# Altium schematic sheet FM33LE025_NB_4 V0.10.SchDoc: WX0.006.694DL
size A2; CompanyName: 浙江威星智能仪表股份有限公司; DocumentNumber: NB阀控水表; Revision: 1A; SheetNumber: 1; SheetTotal: 2; PageSetup: Record=PageOptions|CenterHorizontal=True|CenterVertical=True|PrintScale=1.04|XCorrection=1.00|YCorrection=1.00|PrintKind=0|BorderSize=5000000|LeftOffset=0|BottomOffset=0|Orientation=2|PaperLength=1000|PaperWidth=1000|Scale=100|PaperSource=7|PrintQuality=-3|MediaType=1|DitherType=10|PrintScaleMode=1|PaperKind=A3|PaperIndex=8
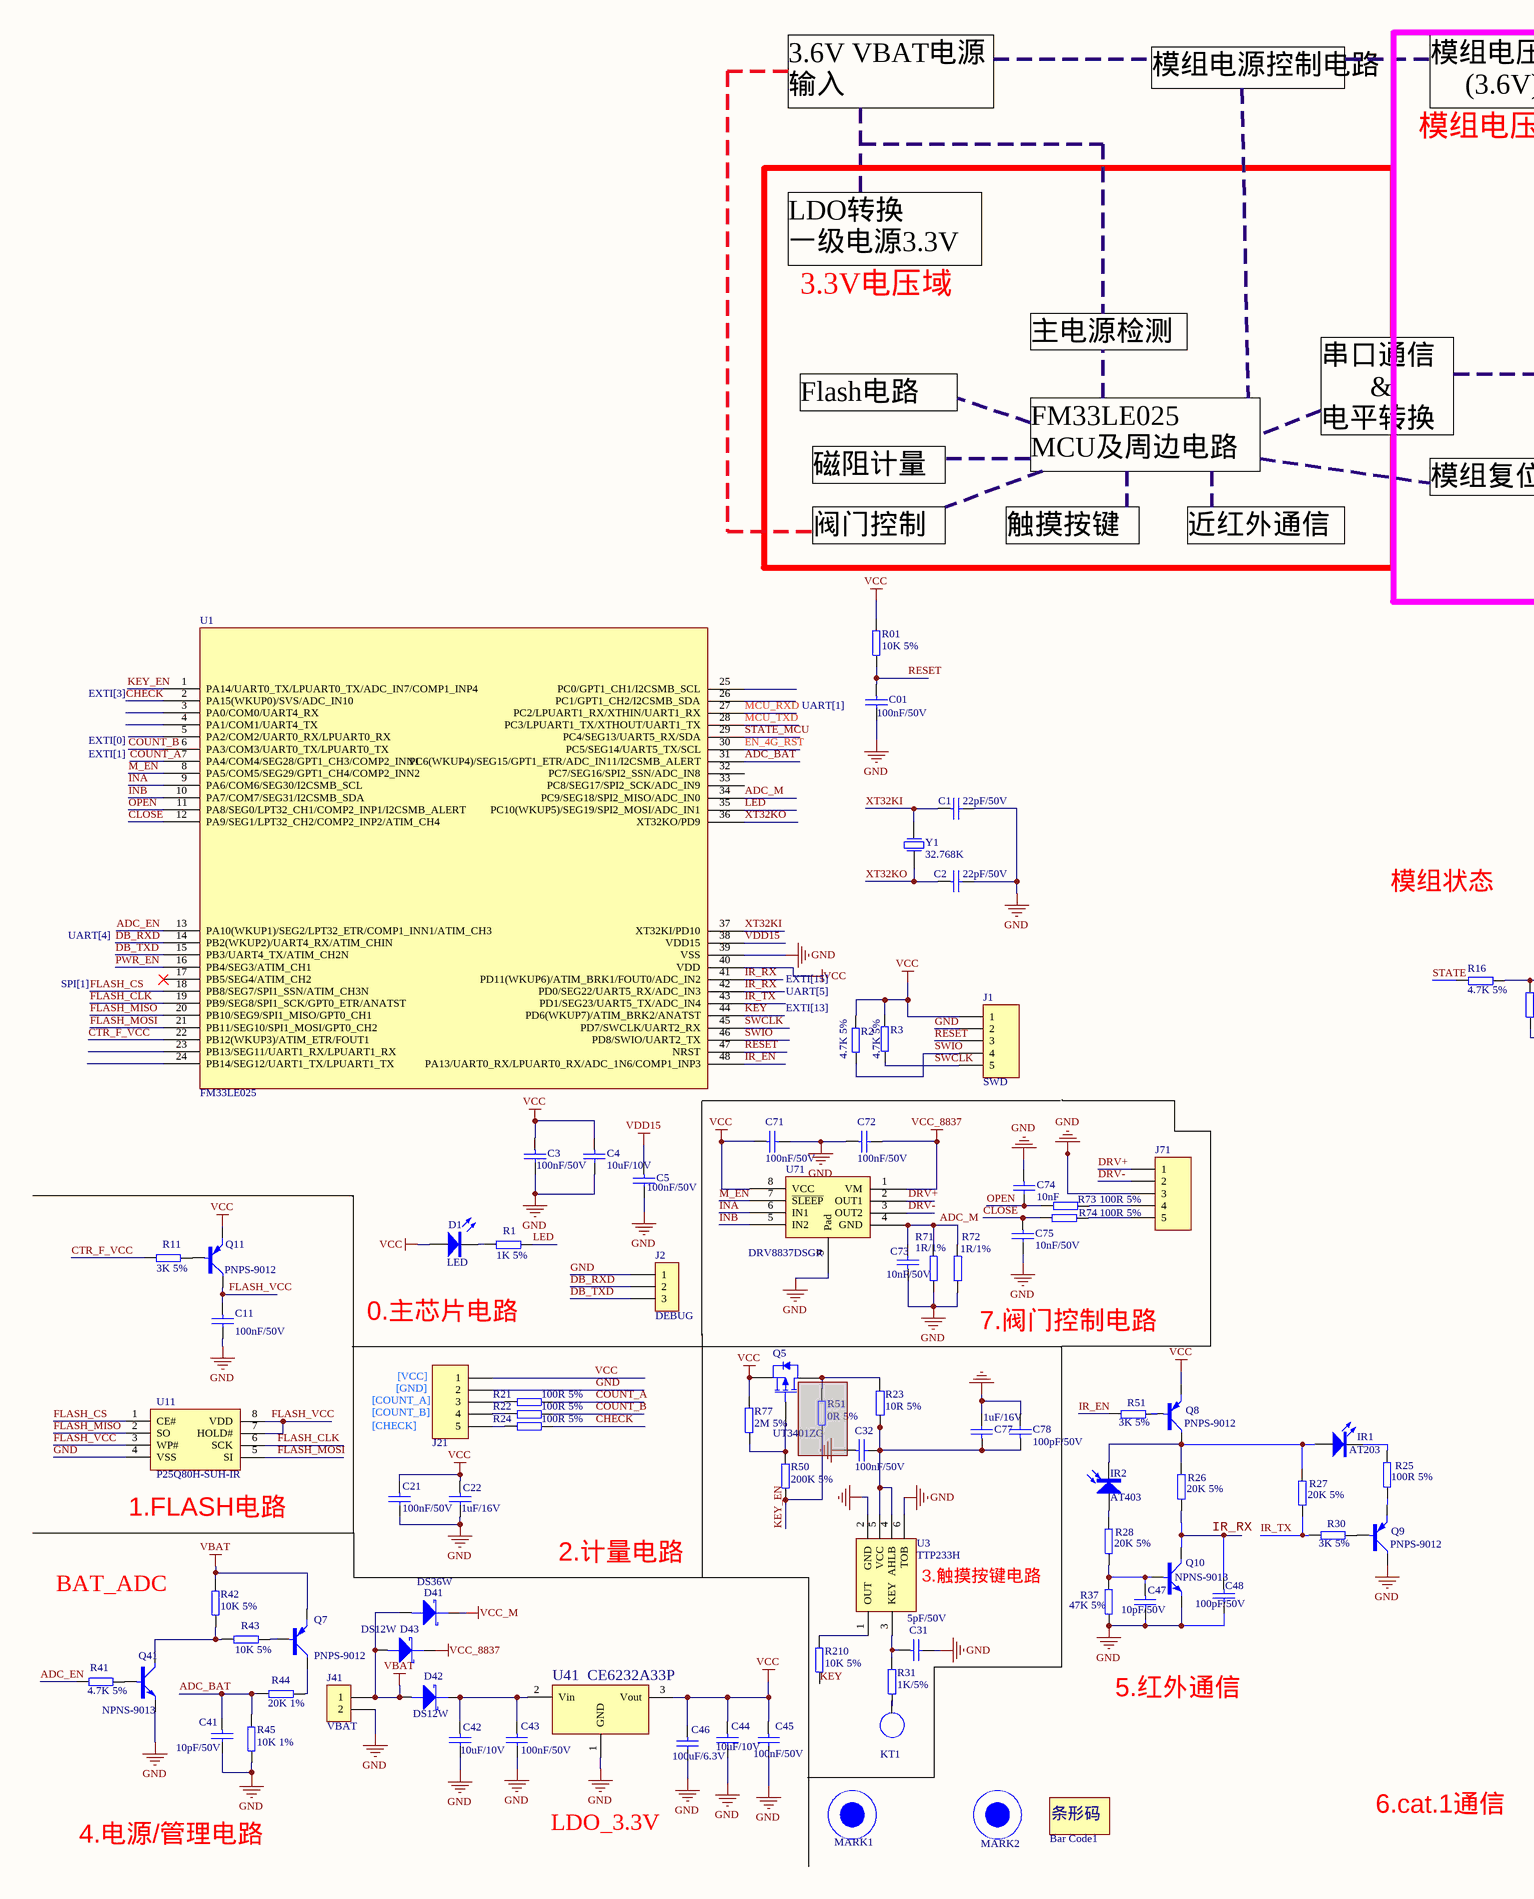
[diagram p0: FM33LE025_NB_4 V0.10.SchDoc, left]
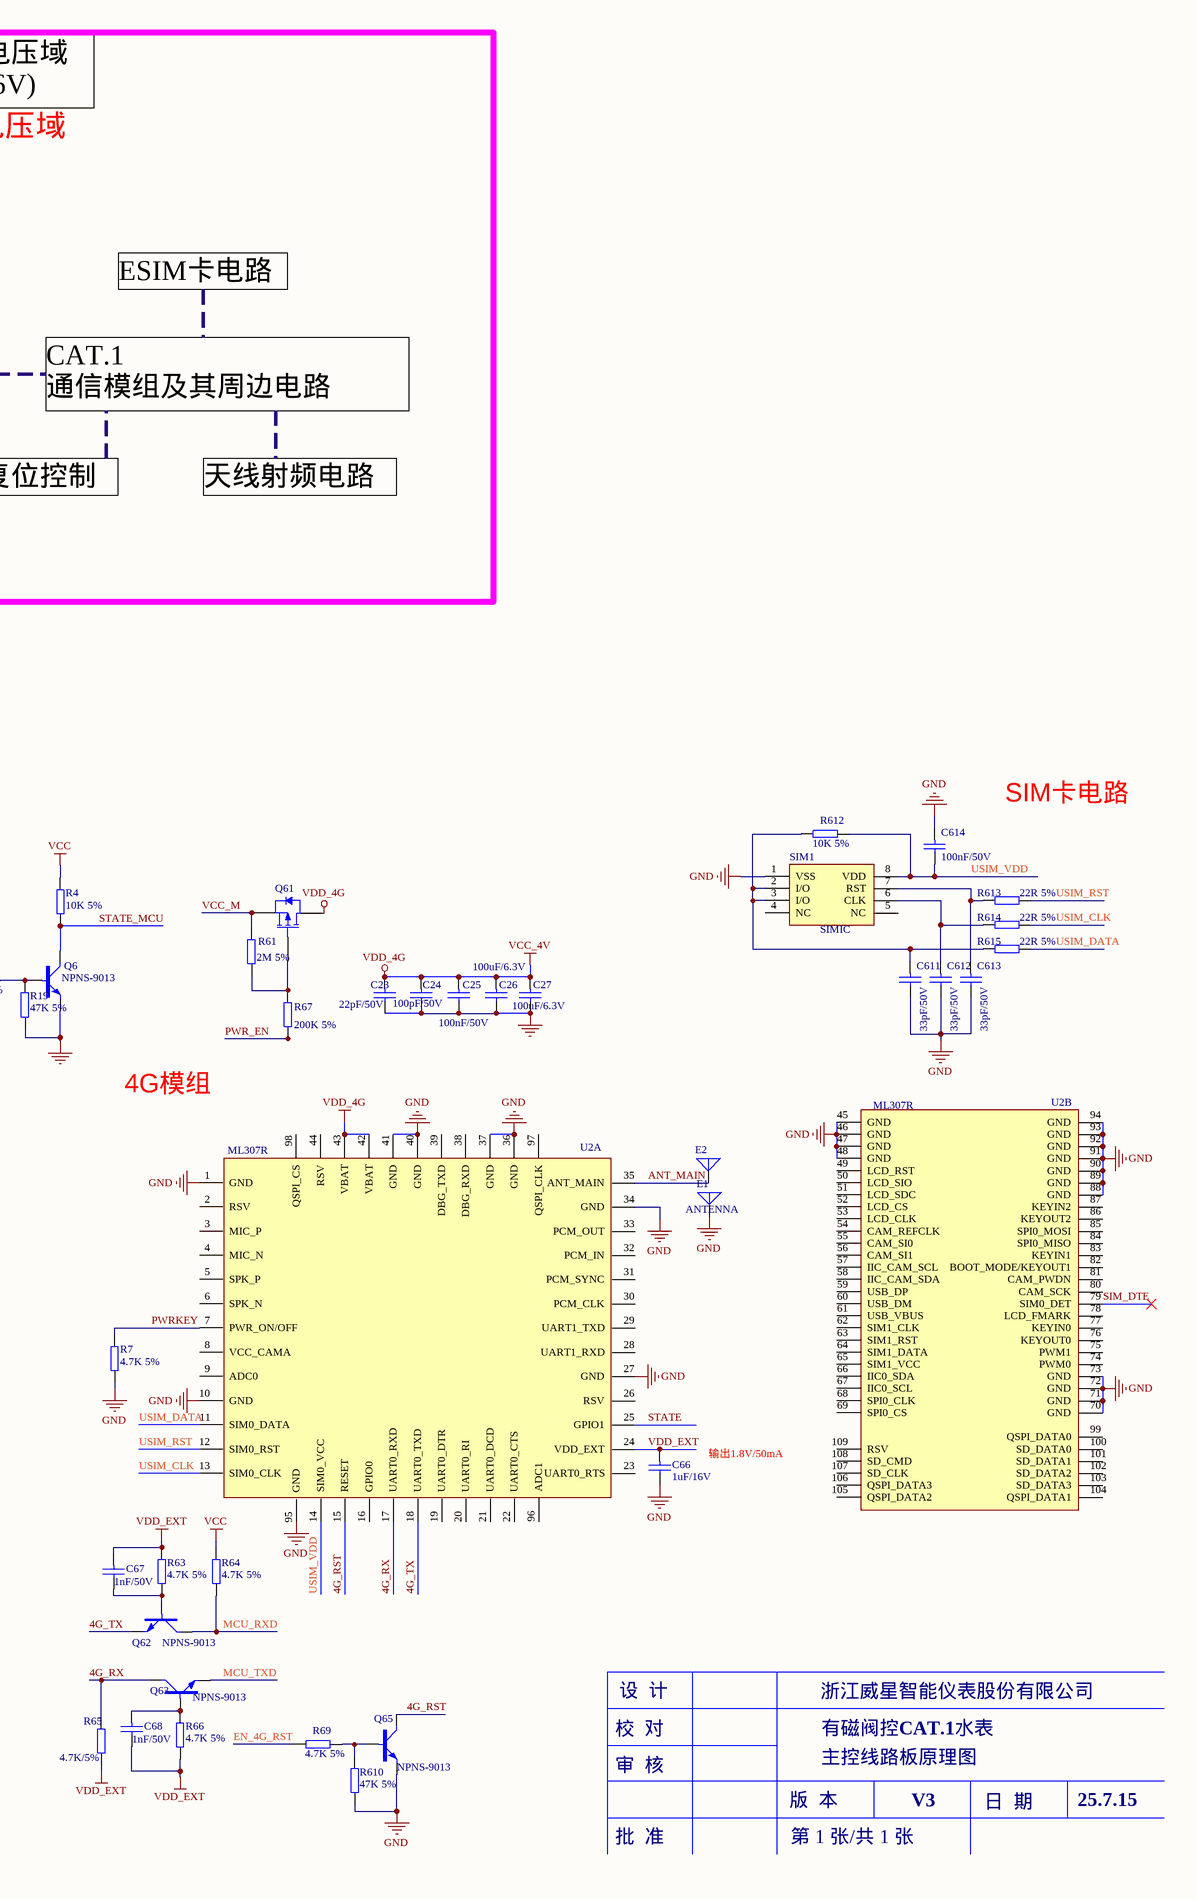
[diagram p1: FM33LE025_NB_4 V0.10.SchDoc, right]

## Parts
(Parts that share a designator on the sheet are numbered #1, #2 ... from top to bottom, then left to right.)
*  Bar Code1  [Bar Code1]
C1  22pF/50V  [CAP0402]
C01  100nF/50V  [CAP0402]
C2  22pF/50V  [CAP0402]
C3  100nF/50V  [CAP0402]
C4  10uF/10V  [CAP0402]
C5  100nF/50V  [CAP0402]
C11  100nF/50V  [CAP0402]
C21  100nF/50V  [CAP0402]
C22  1uF/16V  [CAP0402]
C23  22pF/50V  [CAP0402]
C24  100pF/50V  [CAP0402]
C25  100nF/50V  [CAP0402]
C26  100uF/6.3V  [GRM1206]
C27  100uF/6.3V  [GRM1206]
C31  5pF/50V  [CAP0402]
C32  100nF/50V  [CAP0402]
C41  10pF/50V  [CAP0402]
C42  10uF/10V  [CAP0402]
C43  100nF/50V  [CAP0402]
C44  10uF/10V  [CAP0402]
C45  100nF/50V  [CAP0402]
C46  100uF/6.3V  [GRM1206]
C47  10pF/50V  [CAP0402]
C48  100pF/50V  [CAP0402]
C66  1uF/16V  [CAP0402]
C67  1nF/50V  [CAP0402]
C68  1nF/50V  [CAP0402]
C71  100nF/50V  [CAP0402]
C72  100nF/50V  [CAP0402]
C73  10nF/50V  [CAP0402]
C74  10nF  [CAP0402]
C75  10nF/50V  [CAP0402]
C77  1uF/16V  [CAP0402]
C78  100pF/50V  [CAP0402]
C611  33pF/50V  [CAP0402]
C612  33pF/50V  [CAP0402]
C613  33pF/50V  [CAP0402]
C614  100nF/50V  [CAP0402]
D1  LED  [LED-SMD-0603]
D41  DS36W  [SOD-123FL]
D42  DS12W  [SOD-123FL]
D43  DS12W  [SOD-123FL]
E1  ANTENNA  [ANT-1]
E2  (no value)  [ANT-1]
IR1  AT203  [IR_254_532_300]
IR2  AT403  [IR_254_532_300_RX]
J1  SWD  [J_DIP_2.0_1*05_H]
J2  DEBUG  [PIN254_1*3*WXHJ]  (no BOM)
J21  PIN254_1*5*1100S  [J_DIP_2.0_1*05_H]  (value not drawn)
J41  VBAT  [PIN254_1*2*1200S]
J71  PIN254_1*5*1100S  [J_DIP_2.0_1*05_H]  (value not drawn)
KT1  KEY  [ANT-DIP]  (value not drawn)
MARK1  (no value)  [MARK]  (no BOM)
MARK2  (no value)  [MARK]  (no BOM)
Q5  UT3401ZG  [SOT-23]
Q6  NPNS-9013  [SOT-323-3_L2.0-W1.3-P1.30-LS2.1-BR]
Q7  PNPS-9012  [SOT-323-3_L2.0-W1.3-P1.30-LS2.1-BR]
Q8  PNPS-9012  [SOT-323-3_L2.0-W1.3-P1.30-LS2.1-BR]
Q9  PNPS-9012  [SOT-323-3_L2.0-W1.3-P1.30-LS2.1-BR]
Q10  NPNS-9013  [SOT-323-3_L2.0-W1.3-P1.30-LS2.1-BR]
Q11  PNPS-9012  [SOT-323-3_L2.0-W1.3-P1.30-LS2.1-BR]
Q41  NPNS-9013  [SOT-323-3_L2.0-W1.3-P1.30-LS2.1-BR]
Q61  UT3401ZG  [SOT-23]  (value not drawn)
Q62  NPNS-9013  [SOT-323-3_L2.0-W1.3-P1.30-LS2.1-BR]
Q63  NPNS-9013  [SOT-323-3_L2.0-W1.3-P1.30-LS2.1-BR]
Q65  NPNS-9013  [SOT-323-3_L2.0-W1.3-P1.30-LS2.1-BR]
R1  1K 5%  [RES0402]
R01  10K 5%  [RES0402]
R2  4.7K 5%  [RES0402]
R3  4.7K 5%  [RES0402]
R4  10K 5%  [RES0402]
R7  4.7K 5%  [RES0402]
R11  3K 5%  [RES0402]
R16  4.7K 5%  [RES0402]
R19  47K 5%  [RES0402]
R21  100R 5%  [RES0402]
R22  100R 5%  [RES0402]
R23  10R 5%  [RES0402]
R24  100R 5%  [RES0402]
R25  100R 5%  [RES0402]
R26  20K 5%  [RES0402]
R27  20K 5%  [RES0402]
R28  20K 5%  [RES0402]
R30  3K 5%  [RES0402]
R31  1K/5%  [RES0402]
R37  47K 5%  [RES0402]
R41  4.7K 5%  [RES0402]
R42  10K 5%  [RES0402]
R43  10K 5%  [RES0402]
R44  20K 1%  [RES0402]
R45  10K 1%  [RES0402]
R50  200K 5%  [RES0402]
R51#1  3K 5%  [RES0402]
R51#2  0R 5%  [RES0603]  (masked out: inside a compile mask, not in the netlist)
R61  2M 5%  [RES0402]
R63  4.7K 5%  [RES0402]
R64  4.7K 5%  [RES0402]
R65  4.7K/5%  [RES0402]
R66  4.7K 5%  [RES0402]
R67  200K 5%  [RES0402]
R69  4.7K 5%  [RES0402]
R71  1R/1%  [RES1206]
R72  1R/1%  [RES1206]
R73  100R 5%  [RES0402]
R74  100R 5%  [RES0402]
R77  2M 5%  [RES0402]
R210  10K 5%  [RES0402]
R610  47K 5%  [RES0402]
R612  10K 5%  [RES0402]
R613  22R 5%  [RES0402]
R614  22R 5%  [RES0402]
R615  22R 5%  [RES0402]
SIM1  SIMIC  [SIMIC]
U1  FM33LE025  [LQFP48]
U2  ML307R  [MOD_ML307X_LGA109P]  (parts A,B of 2)
U3  TTP233H  [SOT-23-6]
U11  P25Q80H-SUH-IR  [USON8-EP(2x3)]
U41  CE6232A33P  [SOT-89]
U71  DRV8837DSGR  [S-PWSON-N8]
Y1  32.768K  [SMD-3215_2P]

## Nets
GND: C1.2 C01.2 C2.2 C3.2 C4.2 C5.2 C11.2 C21.2 C22.2 C23.2 C24.2 C25.2 C26.2 C27.2 C31.2 C41.2 C42.2 C43.2 C44.2 C45.2 C46.2 C47.2 C48.2 C66.2 C71.2 C72.1 C73.1 C74.1 C75.2 C77.2 C78.2 C611.2 C612.2 C613.2 C614.1 E1.1(A) J1.2 J2.1 J21.2 J41.2 J71.3 Q6.2(E) Q9.3(C) Q10.2(E) Q41.2(E) Q65.2(E) R7.1 R19.1 R37.1 R45.1 R71.2 R72.2 R610.2 SIM1.1(VSS) U1.39(VSS) U2.1(GND) U2.10(GND) U2.27(GND) U2.34(GND) U2.36(GND) U2.37(GND) U2.40(GND) U2.41(GND) U2.45(GND) U2.46(GND) U2.47(GND) U2.48(GND) U2.70(GND) U2.71(GND) U2.72(GND) U2.73(GND) U2.88(GND) U2.89(GND) U2.90(GND) U2.91(GND) U2.92(GND) U2.93(GND) U2.94(GND) U2.95(GND) U3.2(GND) U3.6(TOB) U11.4(VSS) U41.1(GND) U71.9(Pad)
VBAT: D41.1 D42.1 D43.1 J41.1 Q7.2(E) R42.2
VCC: C3.1 C4.1 C21.1 C22.1 C44.1 C45.1 C46.1 C71.1 D1.A J1.1 J21.1 Q5.2(S) Q8.2(E) Q11.2(E) R01.2 R2.2 R3.2 R4.1 R64.2 R77.2 U1.40(VDD) U41.3(Vout) U71.8(VCC)
VCC_4V: C23.1 C24.1 C25.1 C26.1 C27.1 Q61.3(D) U2.42(VBAT) U2.43(VBAT)  [also labelled VDD_4G]
VCC_8837: C72.2 D43.2 U71.1(VM)
VCC_M: D41.2 Q61.2(S) R61.2
VDD15: C5.1 U1.38(VDD15)
VDD_EXT: C66.1 C67.1 C68.2 R63.2 R65.1 R66.1 U2.24(VDD_EXT)
4G_RST: Q65.3(C) U2.15(RESET)
4G_RX: Q63.3(C) R65.2 U2.17(UART0_RXD)
4G_TX: Q62.2(E) U2.18(UART0_TXD)
ADC_BAT: C41.1 R44.1 R45.2 U1.31(PC6(WKUP4)/SEG15/GPT1_ETR/ADC_IN11/I2CSMB_ALERT)
ADC_EN: R41.1 U1.13(PA10(WKUP1)/SEG2/LPT32_ETR/COMP1_INN1/ATIM_CH3)
ADC_M: C73.2 R71.1 R72.1 U1.34(PC9/SEG18/SPI2_MISO/ADC_IN0) U71.4(GND)
ANT_MAIN: E2.1(A) U2.35(ANT_MAIN)
CHECK: R24.2 U1.2(PA15(WKUP0)/SVS/ADC_IN10)
CLOSE: C75.1 R74.1 U1.12(PA9/SEG1/LPT32_CH2/COMP2_INP2/ATIM_CH4)
COUNT_A: R21.2 U1.7(PA4/COM4/SEG28/GPT1_CH3/COMP2_INN1)
COUNT_B: R22.2 U1.6(PA3/COM3/UART0_TX/LPUART0_TX)
CTR_F_VCC: R11.1 U1.22(PB12(WKUP3)/ATIM_ETR/FOUT1)
DB_RXD: J2.2 U1.14(PB2(WKUP2)/UART4_RX/ATIM_CHIN)
DB_TXD: J2.3 U1.15(PB3/UART4_TX/ATIM_CH2N)
DRV+: J71.1 U71.2(OUT1)
DRV-: J71.2 U71.3(OUT2)
EN_4G_RST: R69.2 U1.30(PC5/SEG14/UART5_TX/SCL)
FLASH_CLK: U1.19(PB9/SEG8/SPI1_SCK/GPT0_ETR/ANATST) U11.6(SCK)
FLASH_CS: U1.18(PB8/SEG7/SPI1_SSN/ATIM_CH3N) U11.1(CE#)
FLASH_MISO: U1.20(PB10/SEG9/SPI1_MISO/GPT0_CH1) U11.2(SO)
FLASH_MOSI: U1.21(PB11/SEG10/SPI1_MOSI/GPT0_CH2) U11.5(SI)
FLASH_VCC: C11.1 Q11.3(C) U11.3(WP#) U11.7(HOLD#) U11.8(VDD)
INA: U1.9(PA6/COM6/SEG30/I2CSMB_SCL) U71.6(IN1)
INB: U1.10(PA7/COM7/SEG31/I2CSMB_SDA) U71.5(IN2)
IR_EN: R51#1.1 U1.48(PA13/UART0_RX/LPUART0_RX/ADC_1N6/COMP1_INP3)
IR_RX: C48.1 Q10.3(C) R26.1 U1.41(PD11(WKUP6)/ATIM_BRK1/FOUT0/ADC_IN2) U1.42(PD0/SEG22/UART5_RX/ADC_IN3)
IR_TX: R27.1 R30.1 U1.43(PD1/SEG23/UART5_TX/ADC_IN4)
KEY: R210.1 U1.44(PD6(WKUP7)/ATIM_BRK2/ANATST)
KEY_EN: R50.1 U1.1(PA14/UART0_TX/LPUART0_TX/ADC_IN7/COMP1_INP4)
LED: R1.2 U1.35(PC10(WKUP5)/SEG19/SPI2_MOSI/ADC_IN1)
M_EN: U1.8(PA5/COM5/SEG29/GPT1_CH4/COMP2_INN2) U71.7(~{SLEEP})
MCU_RXD: Q62.3(C) R64.1 U1.27(PC2/LPUART1_RX/XTHIN/UART1_RX)
MCU_TXD: Q63.2(E) U1.28(PC3/LPUART1_TX/XTHOUT/UART1_TX)
OPEN: C74.2 R73.1 U1.11(PA8/SEG0/LPT32_CH1/COMP2_INP1/I2CSMB_ALERT)
PWR_EN: R67.1 U1.16(PB4/SEG3/ATIM_CH1)
PWRKEY: R7.2 U2.7(PWR_ON/OFF)
RESET: C01.1 J1.3 R01.1 U1.47(NRST)
SIM_DTE: U2.79(SIM0_DET)
STATE: R16.1 U2.25(GPIO1)
STATE_MCU: Q6.3(C) R4.2 U1.29(PC4/SEG13/UART5_RX/SDA)
SWCLK: J1.5 R3.1 U1.45(PD7/SWCLK/UART2_RX)
SWIO: J1.4 R2.1 U1.46(PD8/SWIO/UART2_TX)
USIM_CLK: R614.1 U2.13(SIM0_CLK)
USIM_DATA: R615.1 U2.11(SIM0_DATA)
USIM_RST: R613.1 U2.12(SIM0_RST)
USIM_VDD: C614.2 R612.1 SIM1.8(VDD) U2.14(SIM0_VCC)
XT32KI: C1.1 U1.37(XT32KI/PD10) Y1.2(P2)
XT32KO: C2.1 U1.36(XT32KO/PD9) Y1.1(P1)
NetC31_1: C31.1 R31.2 U3.3(KEY)
NetC32_2: C32.2 C77.1 C78.1 R23.1 U3.4(AHLB) U3.5(VCC)
NetC42_1: C42.1 C43.1 D42.2 U41.2(Vin)
NetC47_1: C47.1 Q10.1(B) R28.1 R37.2
NetC67_2: C67.2 Q62.1(B) R63.1
NetC68_1: C68.1 Q63.1(B) R66.2
NetC611_1: C611.1 R612.2 R615.2 SIM1.2(I/O) SIM1.3(I/O)
NetC612_1: C612.1 R614.2 SIM1.6(CLK)
NetC613_1: C613.1 R613.2 SIM1.7(RST)
NetD1_K: D1.K R1.1
NetIR1_1: IR1.1(A) IR2.2(K) Q8.3(C) R26.2 R27.2
NetIR1_2: IR1.2(K) R25.2
NetIR2_1: IR2.1(A) R28.2
NetJ21_3: J21.3 R21.1
NetJ21_4: J21.4 R22.1
NetJ21_5: J21.5 R24.1
NetJ71_4: J71.4 R73.2
NetJ71_5: J71.5 R74.2
NetKT1_1: KT1.1 R31.1
NetQ5_1: Q5.1(G) R50.2 R77.1
NetQ5_3: Q5.3(D) R23.2
NetQ6_1: Q6.1(B) R16.2 R19.2
NetQ7_1: Q7.1(B) R43.2
NetQ7_3: Q7.3(C) R44.2
NetQ8_1: Q8.1(B) R51#1.2
NetQ9_1: Q9.1(B) R30.2
NetQ9_2: Q9.2(E) R25.1
NetQ11_1: Q11.1(B) R11.2
NetQ41_1: Q41.1(B) R41.2
NetQ41_3: Q41.3(C) R42.1 R43.1
NetQ61_1: Q61.1(G) R61.1 R67.2
NetQ65_1: Q65.1(B) R69.1 R610.1
NetR210_2: R210.2 U3.1(OUT)

Not connected (* = marked no-connect by the designer): C32 1; SIM1 4(NC) 5(NC); U1 3(PA0/COM0/UART4_RX) 4(PA1/COM1/UART4_TX) 5(PA2/COM2/UART0_RX/LPUART0_RX) 17(PB5/SEG4/ATIM_CH2)* 23(PB13/SEG11/UART1_RX/LPUART1_RX) 24(PB14/SEG12/UART1_TX/LPUART1_TX) 25(PC0/GPT1_CH1/I2CSMB_SCL) 26(PC1/GPT1_CH2/I2CSMB_SDA) 32(PC7/SEG16/SPI2_SSN/ADC_IN8) 33(PC8/SEG17/SPI2_SCK/ADC_IN9); U2 2(RSV) 3(MIC_P) 4(MIC_N) 5(SPK_P) 6(SPK_N) 8(VCC_CAMA) 9(ADC0) 16(GPIO0) 19(UART0_DTR) 20(UART0_RI) 21(UART0_DCD) 22(UART0_CTS) 23(UART0_RTS) 26(RSV) 28(UART1_RXD) 29(UART1_TXD) 30(PCM_CLK) 31(PCM_SYNC) 32(PCM_IN) 33(PCM_OUT) 38(DBG_RXD) 39(DBG_TXD) 44(RSV) 49(LCD_RST) 50(LCD_SIO) 51(LCD_SDC) 52(LCD_CS) 53(LCD_CLK) 54(CAM_REFCLK) 55(CAM_SI0) 56(CAM_SI1) 57(IIC_CAM_SCL) 58(IIC_CAM_SDA) 59(USB_DP) 60(USB_DM) 61(USB_VBUS) 62(SIM1_CLK) 63(SIM1_RST) 64(SIM1_DATA) 65(SIM1_VCC) 66(IIC0_SDA) 67(IIC0_SCL) 68(SPI0_CLK) 69(SPI0_CS) 74(PWM0) 75(PWM1) 76(KEYOUT0) 77(KEYIN0) 78(LCD_FMARK) 80(CAM_SCK) 81(CAM_PWDN) 82(BOOT_MODE/KEYOUT1) 83(KEYIN1) 84(SPI0_MISO) 85(SPI0_MOSI) 86(KEYOUT2) 87(KEYIN2) 96(ADC1) 97(QSPI_CLK) 98(QSPI_CS) 99(QSPI_DATA0) 100(SD_DATA0) 101(SD_DATA1) 102(SD_DATA2) 103(SD_DATA3) 104(QSPI_DATA1) 105(QSPI_DATA2) 106(QSPI_DATA3) 107(SD_CLK) 108(SD_CMD) 109(RSV)

## Notes on the sheet
- 模组电源控制电路
- 3.6V VBAT电源输入
- 模组电压域
- 模组电压域
  (3.6V)
- LDO转换
  一级电源3.3V
- 3.3V电压域
- ESIM卡电路
- 主电源检测
- Flash电路
- 串口通信
  &
  电平转换
- CAT.1
  通信模组及其周边电路
- 磁阻计量
- FM33LE025
  MCU及周边电路
- 模组复位控制
- 天线射频电路
- 阀门控制
- 触摸按键
- 近红外通信
- EXTI[3]
- EXTI[1]
- EXTI[0]
- UART[1]
- SIM卡电路
- UART[4]
- 模组状态
- SPI[1]
- EXTI[15]
- UART[5]
- (near R2) EXTI[13]
- 4G模组
- 0.主芯片电路
- 7.阀门控制电路
- (near J21) [COUNT_A]
- [COUNT_B]
- [CHECK]
- (near J21) [GND]
- (near J21) [VCC]
- 输出1.8V/50mA
- (near U11) 1.FLASH电路
- BAT_ADC
- 2.计量电路
- (near U3) 3.触摸按键电路
- 5.红外通信
- 设  计
- 浙江威星智能仪表股份有限公司
- 审  核
- 校  对
- 有磁阀控CAT.1水表
- 主控线路板原理图
- 4.电源/管理电路
- LDO_3.3V
- 6.cat.1通信
- 批  准
- 版  本
- 第 1 张/共 1 张
- V3
- 日  期
- 25.7.15
- 校 对
- 设 计
- 审 核
- PROJECT :
- 标准化
- 工 艺
- Size
- A3
- Docment Number
- Revision
- File
- Date
- Sheet
- of

## Library data of the parts
* = AD_WXHJ_Bar Code_02: 条形码 ,填充，无需焊接器件; ID: 17; SMD/DIP: SMD; Part Number: AD_WXHJ_Bar Code_02; Part Name: 条形码
C1 C2 C23 = 101020103-0009: 22pF,50 V,±5%,0603,国巨,CC0603JRNPO9BN22; Part Name: 0603贴片电容; ID: 16; SMD/DIP: SMD; Part Number: 101020103-0009
C01 C67 C68 = 101020103-0022: 102pF,50 V,±10%,0603,国巨,CC0603KRX7R9BB102; Part Name: 0603贴片电容; ID: 13; SMD/DIP: SMD; Part Number: 101020103-0022
C3-C5 C74 C75 = CC03JPO9_5P
C11 C21 C25 C32 C43 C45 C614 = 101020103-0021: 104pF,50 V,±10%,0603,国巨,CC0603KRX7R9BB104; Part Name: 0603贴片电容; ID: 3; SMD/DIP: SMD; Part Number: 101020103-0021
C22 = 101020103-0003: 105pF,16 V,±10%,0603,国巨,CC0603KRX7R7BB105; Part Number: 101020103-0003
C24 C48 C78 = 101020103-0010: 101pf,50 V,±5%,0603,国巨,CC0603JRNP09BN101; Part Name: 0603贴片电容; ID: 4; SMD/DIP: SMD; Part Number: 101020103-0010
C26 C27 = 101020101-0020: 100uF,6.3 V,±20%,1206,村田,GRM31CR60J107ME39L; Part Name: 贴片电容; ID: 27; SMD/DIP: SMD; Part Number: 101020101-0020
C31 = 101020103-0028: 5P,50 V,±5%,0603,闵达,5P/50V，±5%，0603; Part Number: 101020103-0028
C41 C47 = 101020103-0014: 10pF,50 V,±5%,0603,X7R,国巨,CC0603JRNPO9BN100; Part Name: 0603贴片电容; ID: 7; SMD/DIP: SMD; Part Number: 101020103-0014
C42 C44 C46 = 101020103-0026: 106pF,10 V,±10%,0603,村田,GRM188R61A106KE47D; Part Name: 0603贴片电容; ID: 8; SMD/DIP: SMD; Part Number: 101020103-0026
C66 C77 = 101020103-0003: 105pF,16 V,±10%,0603,国巨,CC0603KRX7R7BB105; Part Name: 0603贴片电容; ID: 14; SMD/DIP: SMD; Part Number: 101020103-0003
C71-C73 = CC03K7R9_100N
C611-C613 = 101020103-0027: 33pF,50 V,±10%,0603,国巨,CC0603KRNPO9BN33; Part Name: 0603贴片电容; ID: 17; SMD/DIP: SMD; Part Number: 101020103-0027
D1 = 101040102-0006: 红色0603,0603,贴片,红光,松涛,红色0603; Part Name: 贴片发光二极管; ID: 41; SMD/DIP: SMD; Part Number: 101040102-0006
D41 = 101040101-0055: DS36W,SOD123-FL,3 A,42 V,60 V,浙江领晨科技有限公司,DS36W; Part Name: 贴片肖特基; ID: 40; SMD/DIP: SMD; Part Number: 101040101-0055
D42 D43 = 101040101-0048: DS12W,SOD-123FL,1 A,0.55 V,20 V,领晨科技,DS12W; Part Name: 贴片肖特基; ID: 9; SMD/DIP: SMD; Part Number: 101040101-0048
E1 = 30: 无磁阀控NB-IOT水表外置天线焊盘; Part Name: 虚拟器件; ID: 30
E2 = 1: 天线,5mm弹簧,电信; ID: 1; Part Number: *; Part Name: 天线
IR1 = 101040102-0010: DIP-2,φ3,插件,红光,上海品观电子有限公司/可得,AT203; Part Name: 红外发射管; ID: 1; SMD/DIP: DIP; Part Number: 101040102-0010
IR2 = 101040102-0011: DIP-2,φ3,插件,红光,上海品观电子有限公司/可得,AT403-PD-01; Part Name: 光敏二极管; ID: 3; SMD/DIP: DIP; Part Number: 101040102-0011
J1 = PIN254_1*5*1100S
J2 = SWD_3: Connector
J41 = PIN254_1*2*1200S
MARK1 MARK2 = 1: 标准Mark点,直径1mm,阻焊开窗3mm; Part Name: 虚拟器件; ID: 1; Part Number: *
Q5 = 101040201-0013: UT3401ZG,P-MOS,SOT-23,UTC,UT3401ZG; Part Name: 功率MOS管; ID: 18; SMD/DIP: SMD; Part Number: 101040201-0013
Q6 Q10 Q41 Q62 Q63 Q65 = 101040201-0002: 9013,NPN,SOT-23,长电,S9013; Part Name: 贴片三极管; ID: 15; SMD/DIP: SMD; Part Number: 101040201-0002
Q7-Q9 Q11 = 101040201-0001: 9012,PNP,SOT-23,JCET;长电,S9012; Part Name: 贴片三极管; ID: 17; SMD/DIP: SMD; Part Number: 101040201-0001
Q61 = 101040201-0013: UT3401ZG,P-MOS,SOT-23,UTC,UT3401ZG; Part Name: 功率MOS管; ID: 19; SMD/DIP: SMD; Part Number: 101040201-0013
R1 = 101010103-0008: 1K,±5%,1/10W,0603,国巨,RC0603JR-071KL; Part Name: 0603贴片电阻; ID: 10; SMD/DIP: SMD; Part Number: 101010103-0008
R01 R7 R16 R41 R63-R66 R69 = 101010103-0042: 4.7K±5%,1/10W,0603; Part Name: 0603贴片电阻; ID: 24; SMD/DIP: SMD; Part Number: 101010103-0042
R2 R3 = RC03J_1M
R4 R42 R43 R210 R612 = 101010103-0003: 国巨,±5%,0603,,155 ℃,-55 ℃,RC0603JR-0710KL,无铅,200 ppm/℃,1/10W,,10K; Part Name: 0603贴片电阻; ID: 7; SMD/DIP: SMD; Part Number: 101010103-0003
R11 R30 R51#1 = 101010103-0006: 国巨,±5%,0603,,155 ℃,-55 ℃,RC0603JR-073KL,无铅,100 ppm/℃,1/10W,,3K; Part Name: 0603贴片电阻; ID: 23; SMD/DIP: SMD; Part Number: 101010103-0006
R19 R37 R610 = 101010103-0012: 47K,±5%,1/10W,0603,国巨,RC0603JR-0747KL; Part Name: 0603贴片电阻; ID: 26; SMD/DIP: SMD; Part Number: 101010103-0012
R21 R22 R24 = 101010103-0041: 100Ω,±1%,1/10W,0603,国巨股份有限公司,RC0603FR-07100RL; Part Name: 0603贴片电阻; ID: 4; SMD/DIP: SMD; Part Number: 101010103-0041
R23 = RES: Part Name: 0603贴片电阻; Part Number: 101010101-0012; SMD/DIP: SMD
R25 = 101010103-0022: 100R,±5%,1/10W,0603,国巨,RC0603JR-07100RL; Part Name: 0603贴片电阻; ID: 5; SMD/DIP: SMD; Part Number: 101010103-0022
R26-R28 = 101010103-0004: 国巨,±5%,0603,,155 ℃,-55 ℃,RC0603JR-0720KL,无铅,200 ppm/℃,1/10W,,20K; Part Name: 0603贴片电阻; ID: 15; SMD/DIP: SMD; Part Number: 101010103-0004
R31 R71-R74 = RC03J_1K
R44 = 101010103-0048: 20K,±1%,1/10W,0603,国巨,RC0603FR-0720KL; Part Name: 0603贴片电阻; ID: 14; SMD/DIP: SMD; Part Number: 101010103-0048
R45 = 101010103-0052: 10K±1%,1/10W,0603; Part Name: 0603贴片电阻; ID: 6; SMD/DIP: SMD; Part Number: 101010103-0052
R50 R67 = 101010103-0034: 200K,±5%,1/10W,0603,国巨,RC0603JR-07200KL; Part Name: 0603贴片电阻; ID: 13; SMD/DIP: SMD; Part Number: 101010103-0034
R51#2 = 101010103-0001: 国巨,±5%,0603,,155 ℃,-55 ℃,RC0603J2-070RL,无铅,200 ppm/℃,1/10W,,0R; Part Name: 0603贴片电阻; ID: 1; SMD/DIP: SMD; Part Number: 101010103-0001
R61 R77 = 101010103-0025: 国巨,±5%,0603,,155 ℃,-55 ℃,RC0603JR-072ML,含铅,100 ppm/℃,1/10W,,2M; Part Name: 0603贴片电阻; ID: 20; SMD/DIP: SMD; Part Number: 101010103-0025
R613-R615 = 101010103-0009: 国巨,±5%,0603,,155 ℃,-55 ℃,RC0603JR-0722RL,无铅,200 ppm/℃,1/10W,,22欧; Part Name: 0603贴片电阻; ID: 18; SMD/DIP: SMD; Part Number: 101010103-0009
SIM1 = AD_XN_SIMIC_01: SIMIC虚拟器件; ID: 21; SMD/DIP: SMD; Part Number: AD_XN_SIMIC_01; Part Name: SIMIC
U1 = FM33LE0x5
U2 = 15: 集成电路,中国移动，ML307R; Manufacturer: 中国移动; Vendor: 中移物联网有限公司; Value: ML307X; ID: 15; PCB DECAL: MOD_ML307X_LGA109P; Part Name: 集成电路
U3 = 09_TTP233H-HA6
U11 = 101050101-0218: P25Q80H-SUH-IR,SOP8208mil,普冉半导体（上海）股份有限公司,P25Q80H-SUH-IR; Part Name: 贴片存储芯片FLASH; ID: 35; SMD/DIP: SMD; Part Number: 101050101-0218
U41 = 1010503-0029: CE6232-3.3,CE6232-3.3,SOT89-3,8V,1.8V,0.11V,3.3V,300mA,0.8uA,南京芯力微电子有限公司; Part Name: 线性稳压芯片; ID: 5; SMD/DIP: SMD; Part Number: 1010503-0029
U71 = 07_DRV8837DSGR
Y1 = XTAL: Crystal Oscillator